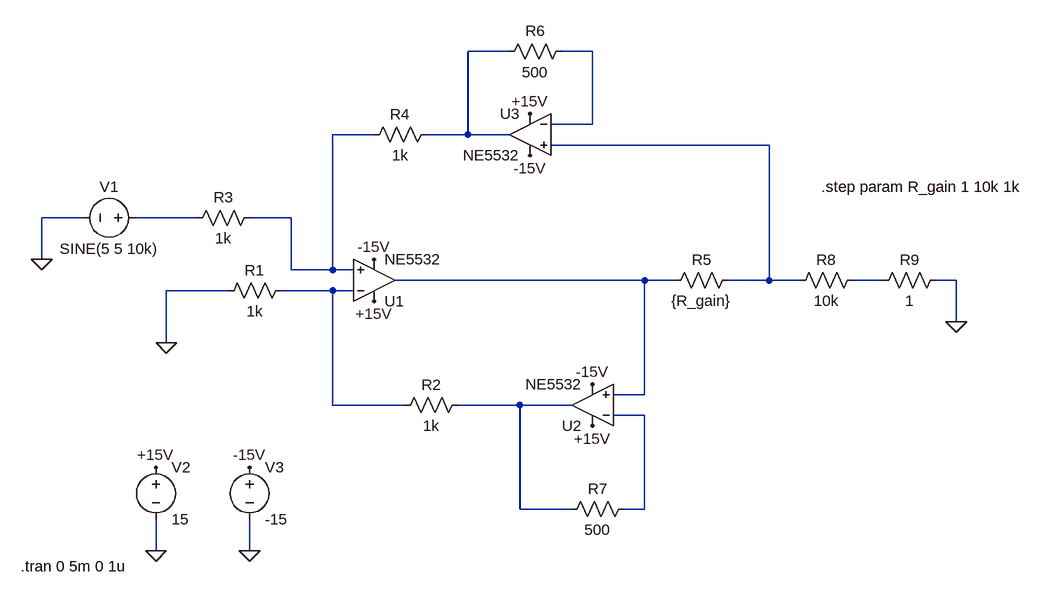
[diagram p0: schematic Fuent de Howland.asc]
Fuent de Howland.asc, the LTspice schematic file:
Version 4.1
SHEET 1 1044 680
WIRE 208 -208 144 -208
WIRE 336 -208 288 -208
WIRE 336 -96 336 -208
WIRE 336 -96 272 -96
WIRE 0 -80 -64 -80
WIRE 144 -80 144 -208
WIRE 144 -80 80 -80
WIRE 208 -80 144 -80
WIRE 608 -64 272 -64
WIRE -448 48 -512 48
WIRE -272 48 -368 48
WIRE -128 48 -192 48
WIRE -512 112 -512 48
WIRE -128 128 -128 48
WIRE -64 128 -64 -80
WIRE -64 128 -128 128
WIRE -32 128 -64 128
WIRE 416 144 32 144
WIRE 464 144 416 144
WIRE 608 144 608 -64
WIRE 608 144 544 144
WIRE 656 144 608 144
WIRE 784 144 736 144
WIRE 896 144 864 144
WIRE -224 160 -320 160
WIRE -64 160 -144 160
WIRE -32 160 -64 160
WIRE 896 208 896 144
WIRE -320 240 -320 160
WIRE 416 320 416 144
WIRE 416 320 368 320
WIRE -64 336 -64 160
WIRE 48 336 -64 336
WIRE 224 336 128 336
WIRE 304 336 224 336
WIRE 416 352 368 352
WIRE 224 496 224 336
WIRE 304 496 224 496
WIRE 416 496 416 352
WIRE 416 496 384 496
WIRE -336 560 -336 512
WIRE -192 560 -192 512
FLAG -320 240 0
FLAG -512 112 0
FLAG -336 560 0
FLAG -192 560 0
FLAG 896 208 0
FLAG -336 432 +15V
FLAG 240 -112 +15V
FLAG 0 176 +15V
FLAG 336 368 +15V
FLAG -192 432 -15V
FLAG 0 112 -15V
FLAG 240 -48 -15V
FLAG 336 304 -15V
SYMBOL sym\\ZZZ\\OpAmp\\NE5532 0 144 M180
SYMATTR InstName U1
SYMBOL sym\\ZZZ\\OpAmp\\NE5532 336 336 R180
SYMATTR InstName U2
SYMBOL sym\\ZZZ\\OpAmp\\NE5532 240 -80 M0
SYMATTR InstName U3
SYMBOL res -128 144 R90
WINDOW 0 0 56 VBottom 2
WINDOW 3 32 56 VTop 2
SYMATTR InstName R1
SYMATTR Value 1k
SYMBOL res 144 320 R90
WINDOW 0 0 56 VBottom 2
WINDOW 3 32 56 VTop 2
SYMATTR InstName R2
SYMATTR Value 1k
SYMBOL res -176 32 R90
WINDOW 0 0 56 VBottom 2
WINDOW 3 32 56 VTop 2
SYMATTR InstName R3
SYMATTR Value 1k
SYMBOL res 96 -96 R90
WINDOW 0 0 56 VBottom 2
WINDOW 3 32 56 VTop 2
SYMATTR InstName R4
SYMATTR Value 1k
SYMBOL res 560 128 R90
WINDOW 0 0 56 VBottom 2
WINDOW 3 32 56 VTop 2
SYMATTR InstName R5
SYMATTR Value {R_gain}
SYMBOL res 304 -224 R90
WINDOW 0 0 56 VBottom 2
WINDOW 3 32 56 VTop 2
SYMATTR InstName R6
SYMATTR Value 500
SYMBOL voltage -352 48 R90
WINDOW 0 -32 56 VBottom 2
WINDOW 3 32 56 VTop 2
WINDOW 123 0 0 Left 0
WINDOW 39 0 0 Left 0
SYMATTR InstName V1
SYMATTR Value SINE(5 5 10k)
SYMBOL voltage -336 416 R0
WINDOW 123 0 0 Left 0
WINDOW 39 0 0 Left 0
SYMATTR InstName V2
SYMATTR Value 15
SYMBOL voltage -192 416 R0
WINDOW 123 0 0 Left 0
WINDOW 39 0 0 Left 0
SYMATTR InstName V3
SYMATTR Value -15
SYMBOL res 400 480 R90
WINDOW 0 0 56 VBottom 2
WINDOW 3 32 56 VTop 2
SYMATTR InstName R7
SYMATTR Value 500
SYMBOL res 752 128 R90
WINDOW 0 0 56 VBottom 2
WINDOW 3 32 56 VTop 2
SYMATTR InstName R8
SYMATTR Value 10k
SYMBOL res 880 128 R90
WINDOW 0 0 56 VBottom 2
WINDOW 3 32 56 VTop 2
SYMATTR InstName R9
SYMATTR Value 1
TEXT -544 584 Left 2 !.tran 0 5m 0 1u
TEXT 688 0 Left 2 !.step param R_gain 1 10k 1k

The netlist it stands for:
* Fuent de Howland.asc
X§U1 N003 N008 +15V -15V N006 NE5532  ; pins In+ In- V+ V- OUT
X§U2 N006 N010 +15V -15V N009 NE5532  ; pins In+ In- V+ V- OUT
X§U3 N004 N002 +15V -15V N001 NE5532  ; pins In+ In- V+ V- OUT
R1 N008 0 1k
R2 N009 N008 1k
R3 N003 N005 1k
R4 N001 N003 1k
R5 N004 N006 {R_gain}
R6 N002 N001 500
V1 N005 0 SINE(5 5 10k)
V2 +15V 0 15
V3 -15V 0 -15
R7 N010 N009 500
R8 N007 N004 10k
R9 0 N007 1
.tran 0 5m 0 1u
.step param R_gain 1 10k 1k
.backanno
.end